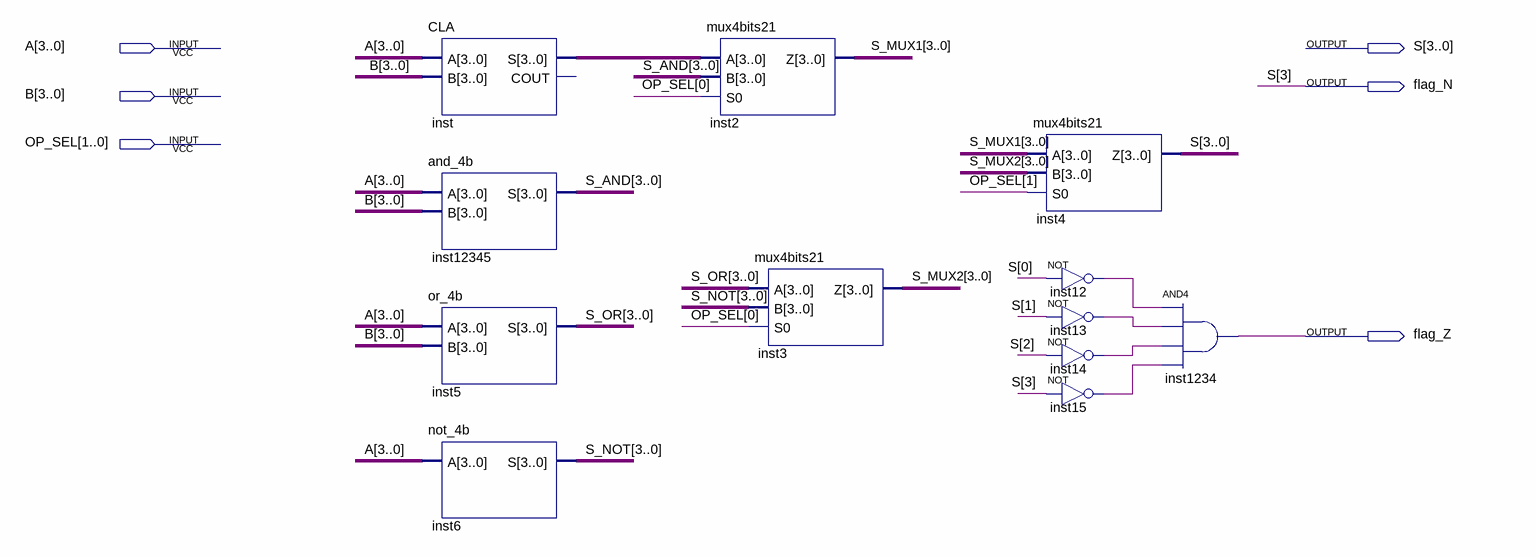
[diagram p0: schematic sheet]
// Quartus schematic ULA2.bdf as structural Verilog: 12 symbols, 6 pins
module ULA2 (
  input  [3:0] A,
  input  [3:0] B,
  input  [1:0] OP_SEL,
  output [3:0] S,
  output flag_N,
  output flag_Z
);

  wire inst12_out, inst13_out, inst14_out, inst15_out;
  wire [3:0] inst_s, S_AND, S_MUX1, S_MUX2, S_NOT, S_OR;

  CLA inst (.A(A), .B(B), .S(inst_s));  // open: COUT
  and_4b inst12345 (.A(A), .B(B), .S(S_AND));
  or_4b inst5 (.A(A), .B(B), .S(S_OR));
  not_4b inst6 (.A(A), .S(S_NOT));
  mux4bits21 inst2 (.A(inst_s), .B(S_AND), .S0(OP_SEL[0]), .Z(S_MUX1));
  mux4bits21 inst3 (.A(S_OR), .B(S_NOT), .S0(OP_SEL[0]), .Z(S_MUX2));
  mux4bits21 inst4 (.A(S_MUX1), .B(S_MUX2), .S0(OP_SEL[1]), .Z({flag_N, S[2:0]}));
  not inst12 (inst12_out, S[0]);
  not inst13 (inst13_out, S[1]);
  not inst14 (inst14_out, S[2]);
  not inst15 (inst15_out, flag_N);
  and inst1234 (flag_Z, inst12_out, inst13_out, inst14_out, inst15_out);

  assign S[3] = flag_N;
endmodule
